# EAGLE schematic STM32f407layout (EAGLE 7.5.0)
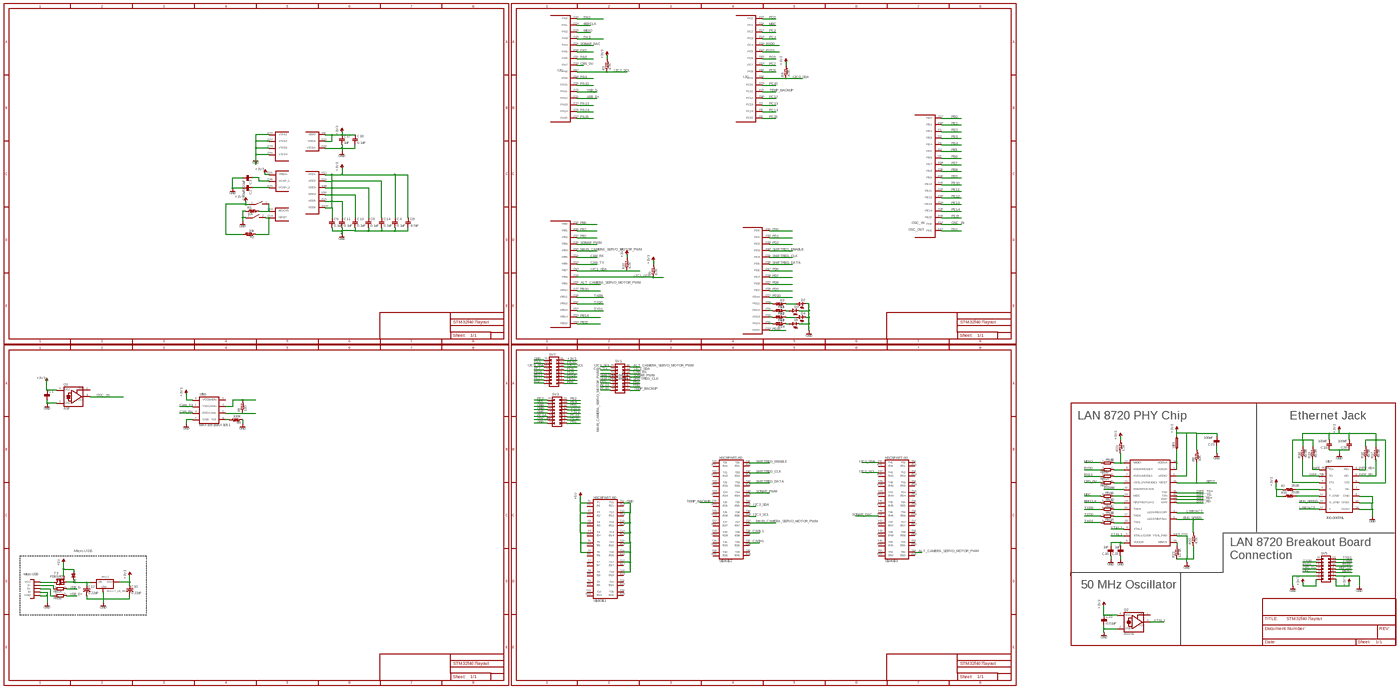
[diagram p0: schematic, sheet 1, overview]
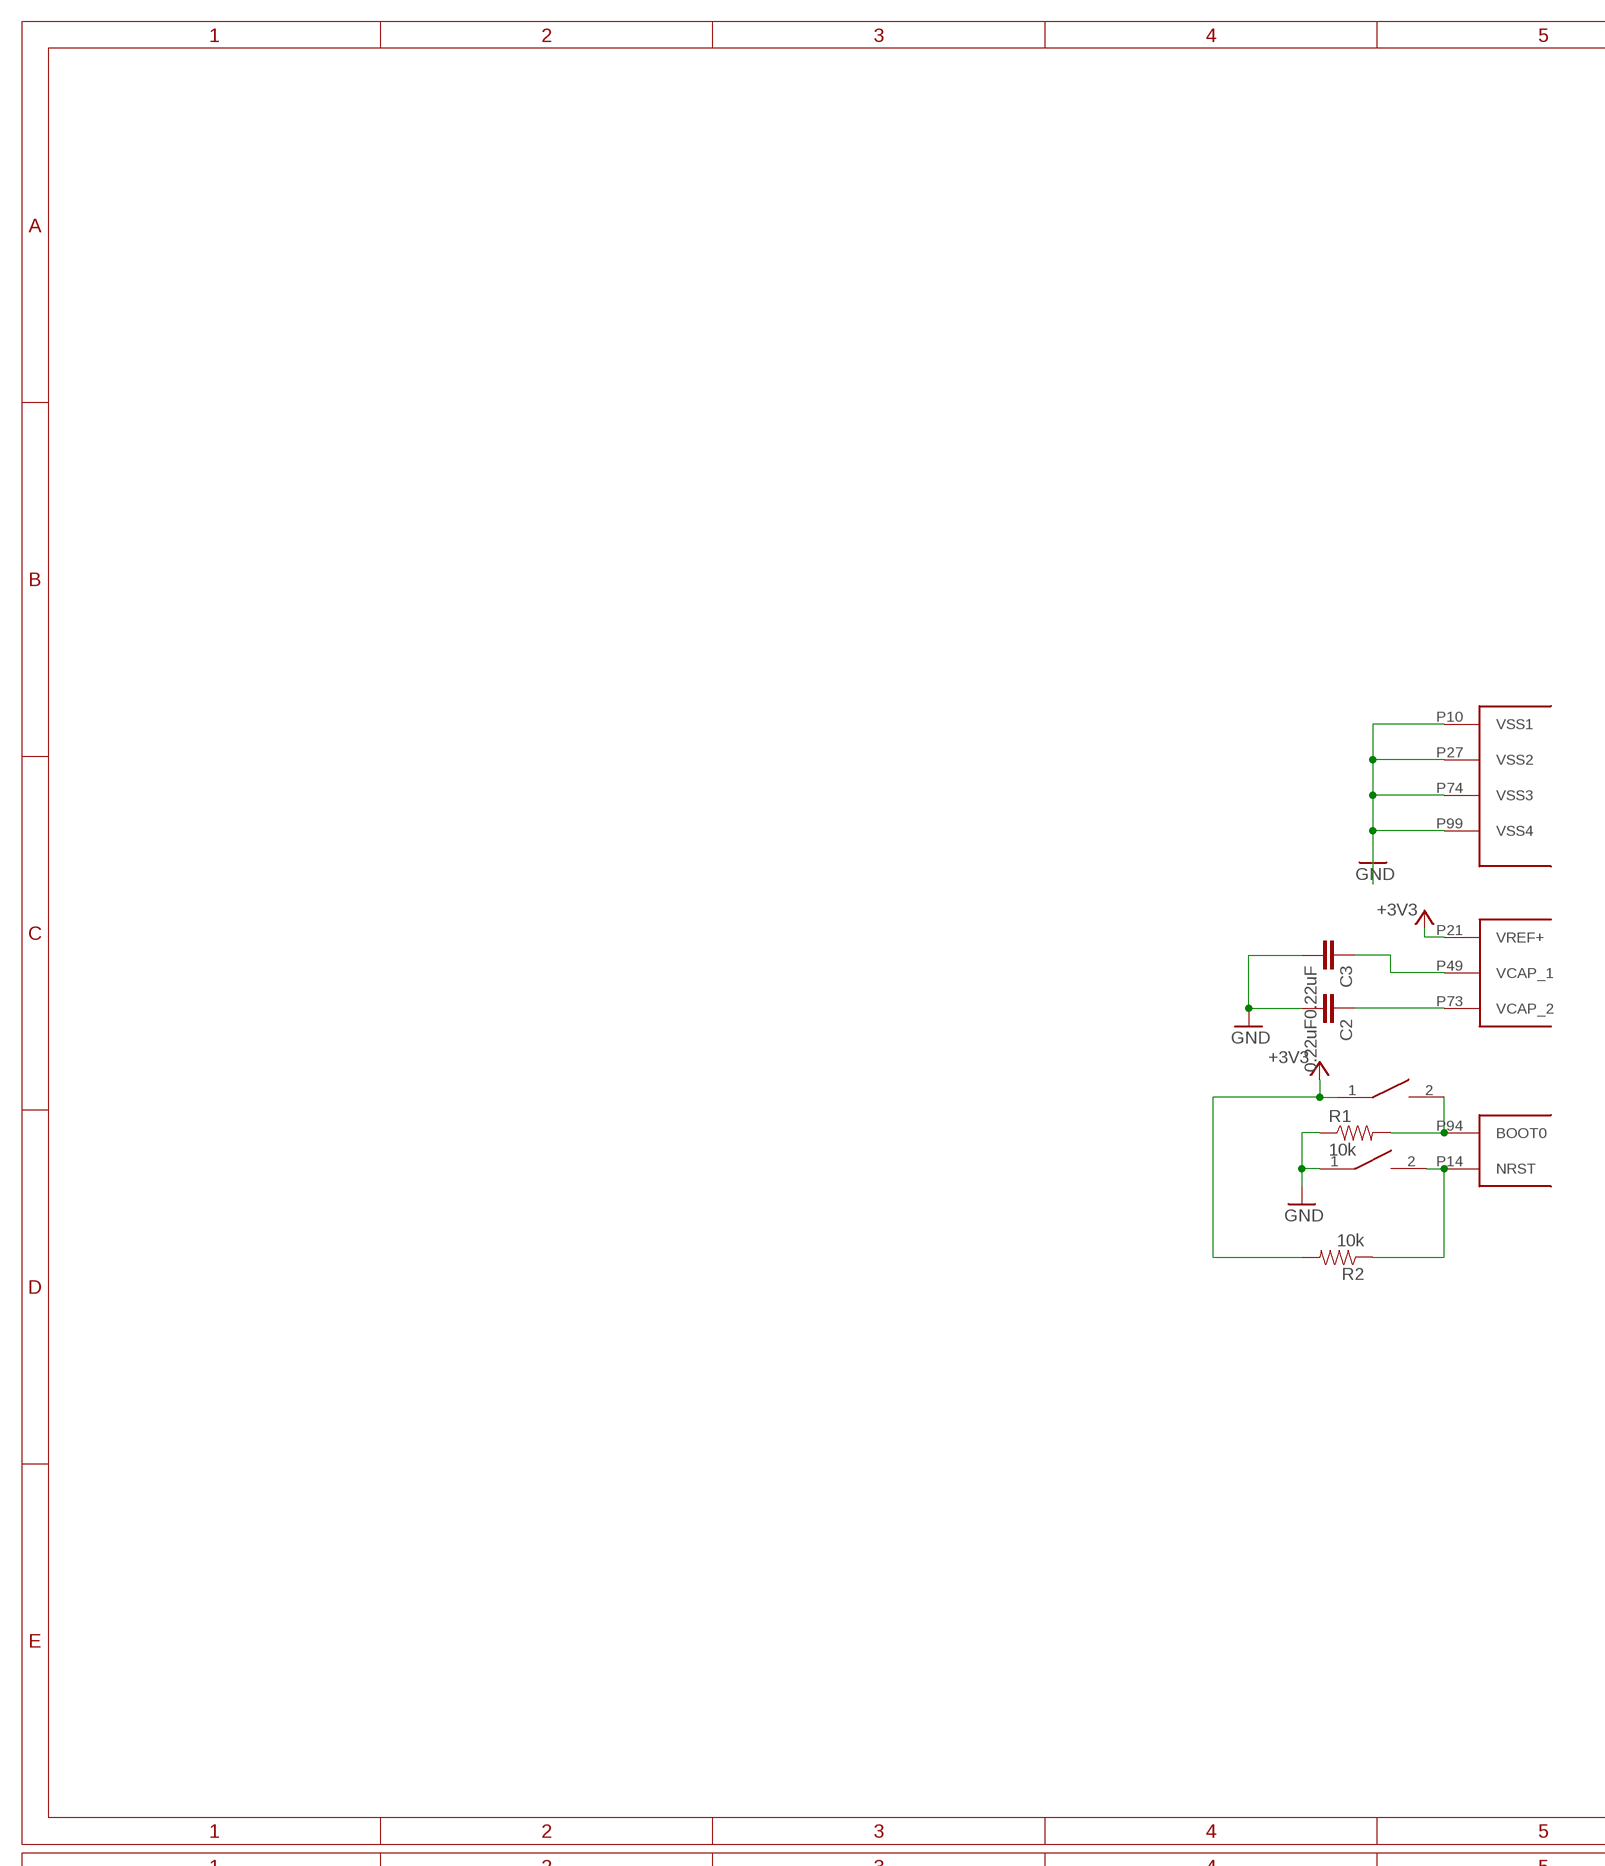
[diagram p1: schematic, sheet 1, part 1 of 7]
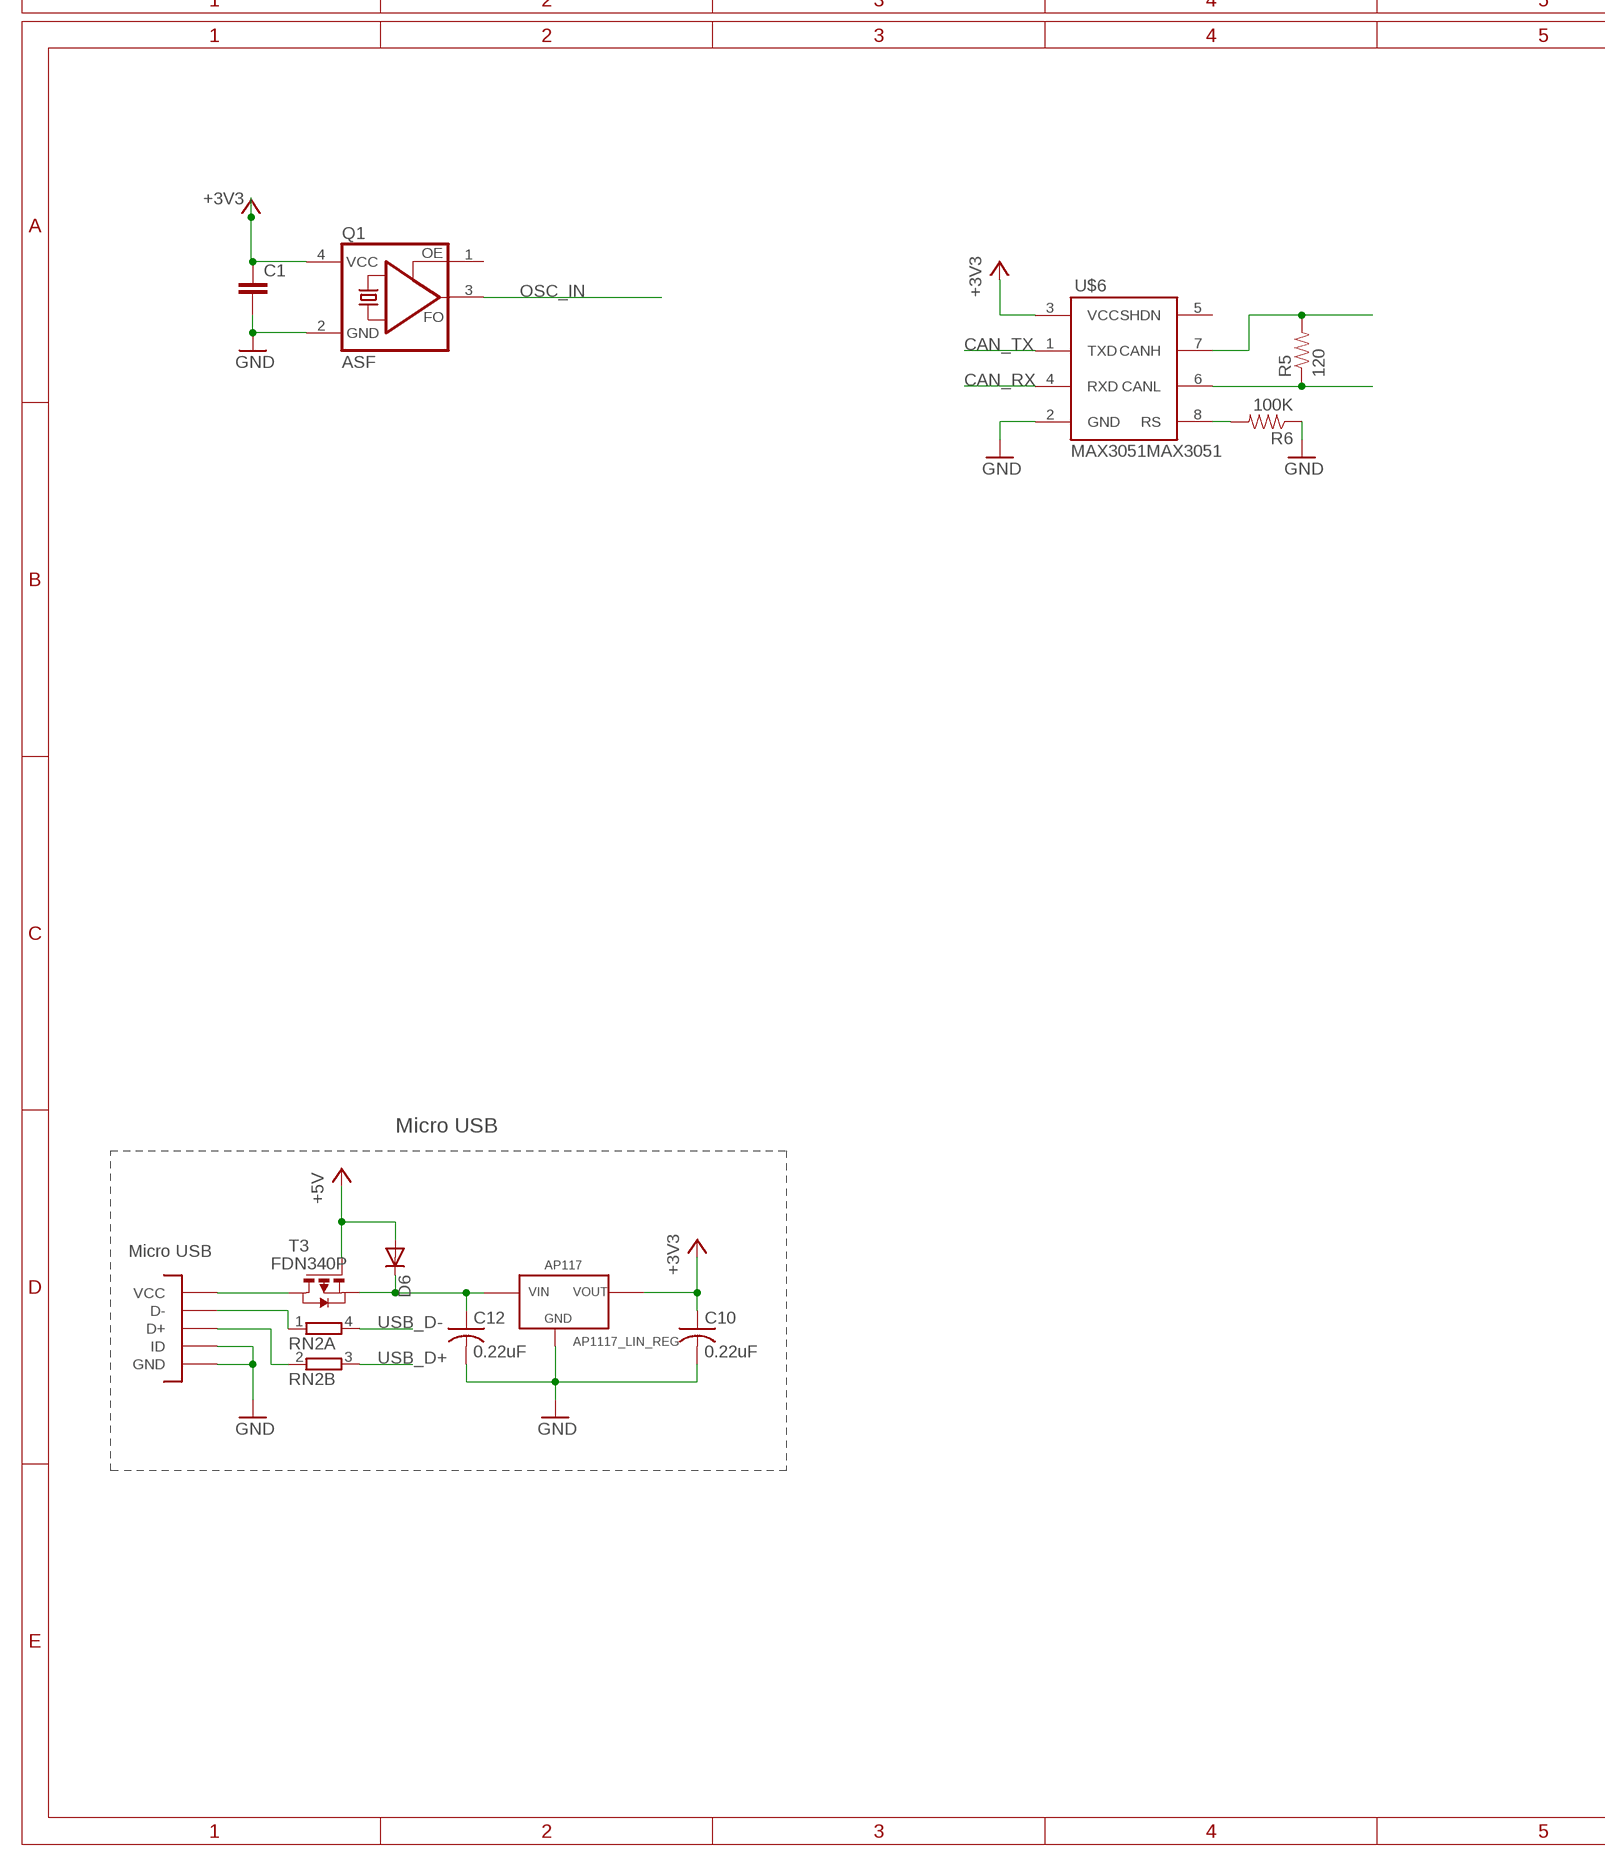
[diagram p2: schematic, sheet 1, part 2 of 7]
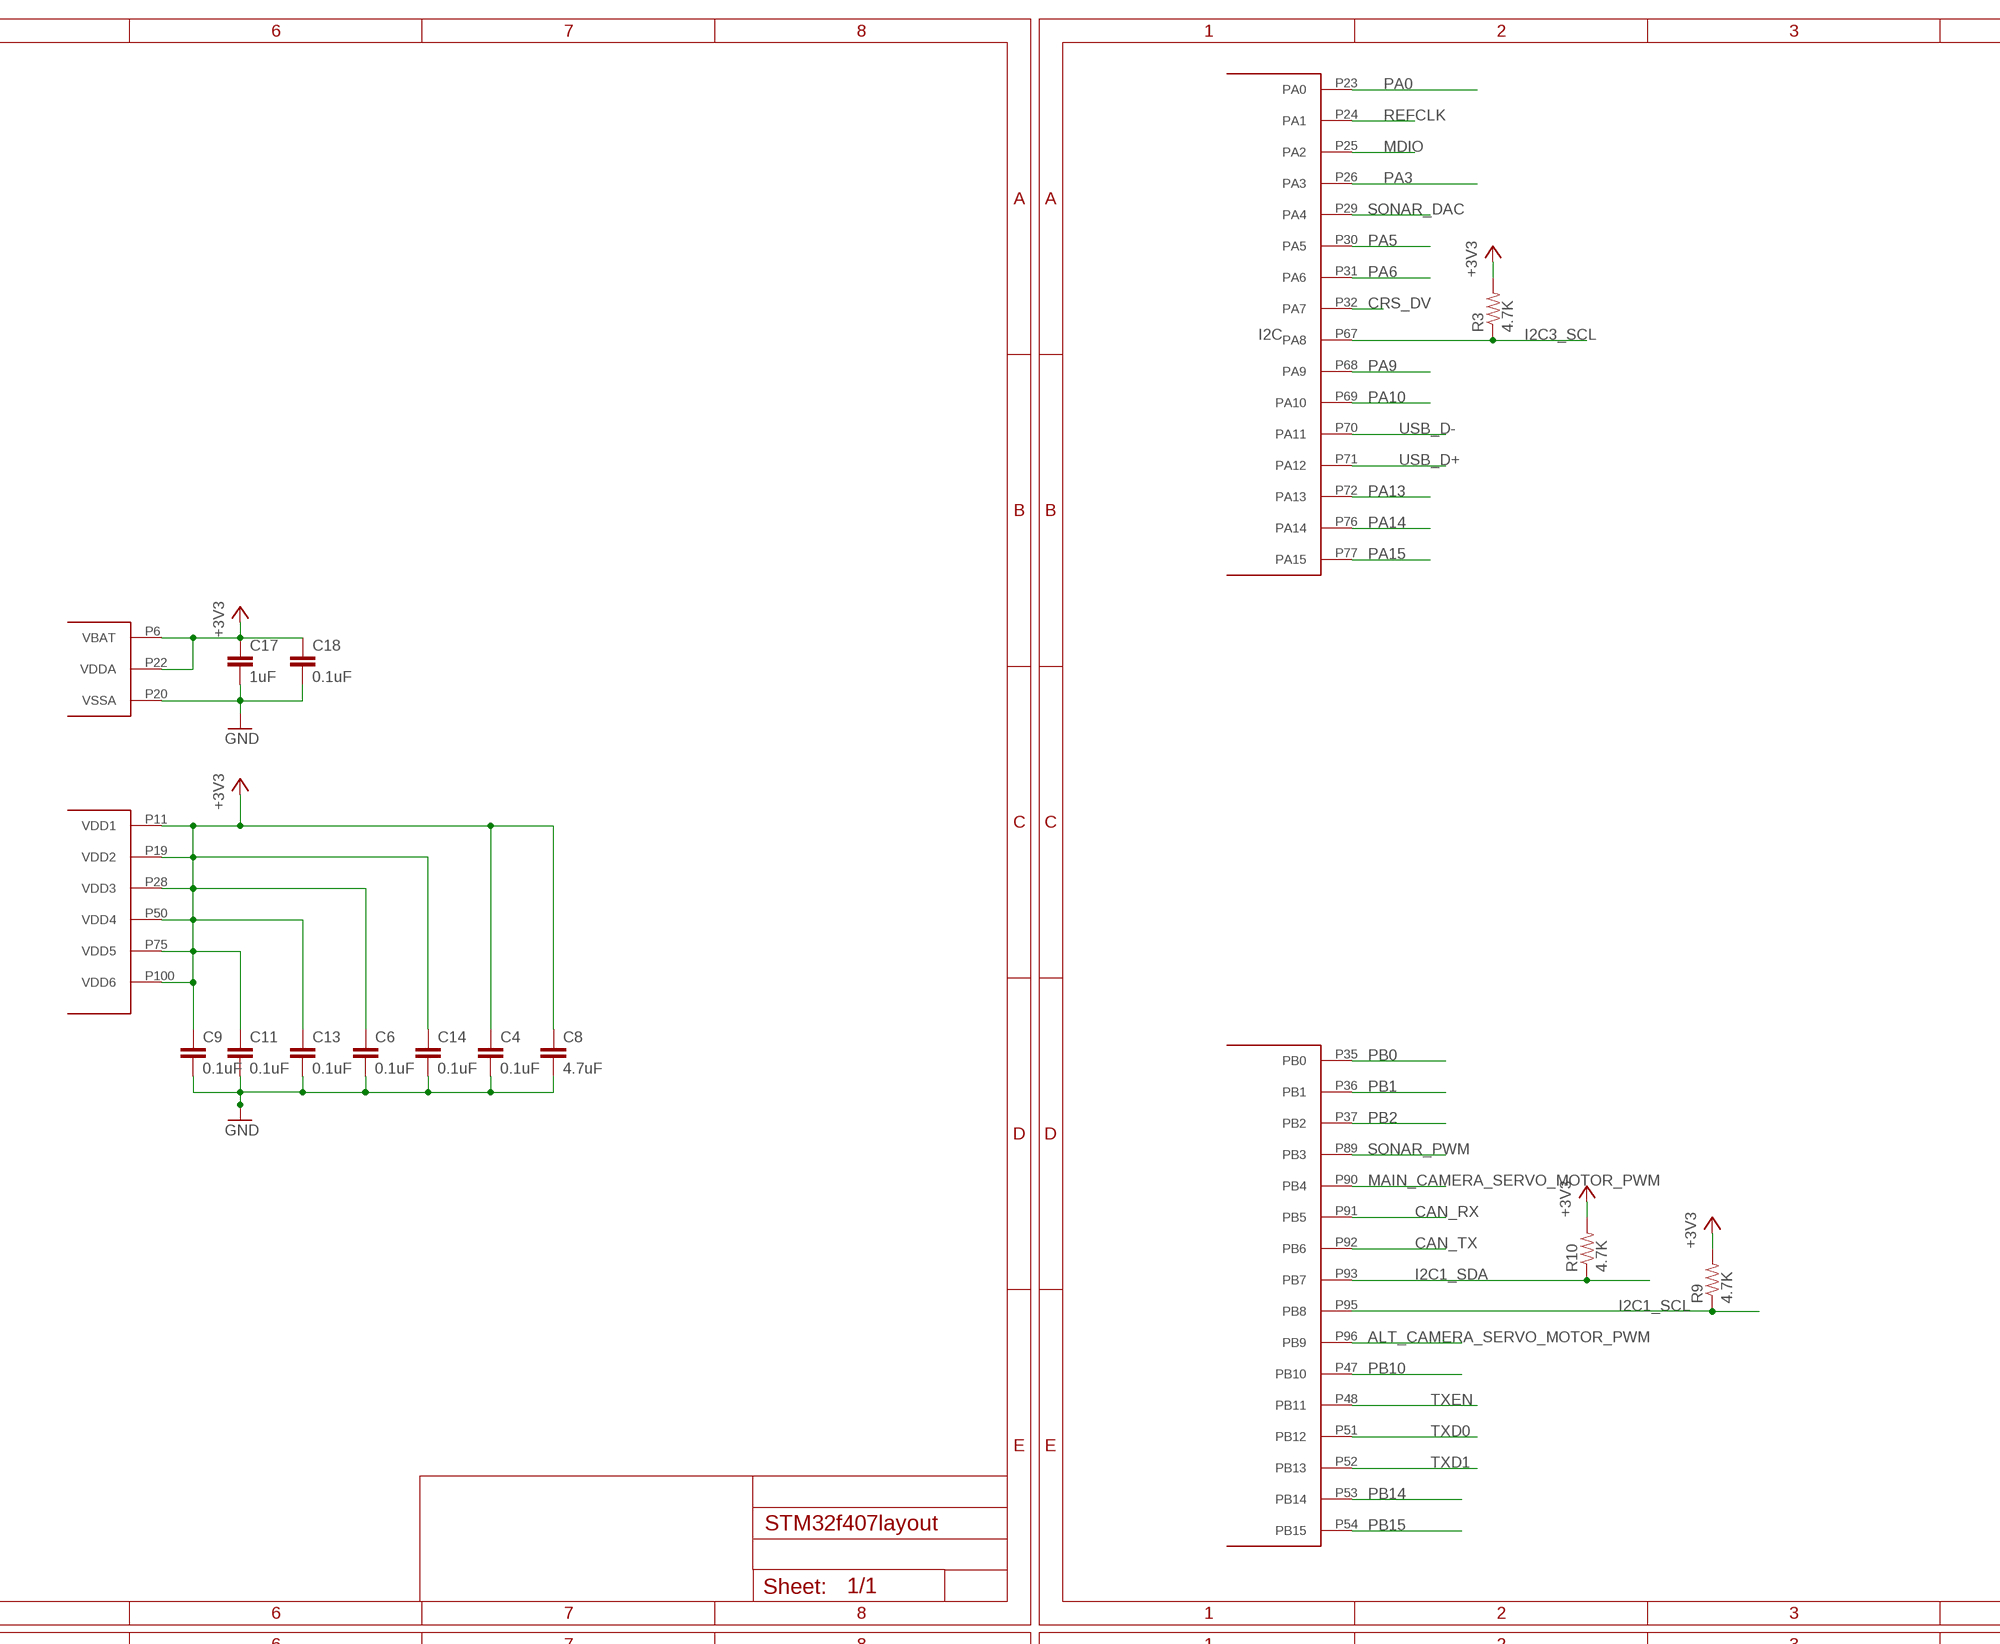
[diagram p3: schematic, sheet 1, part 3 of 7]
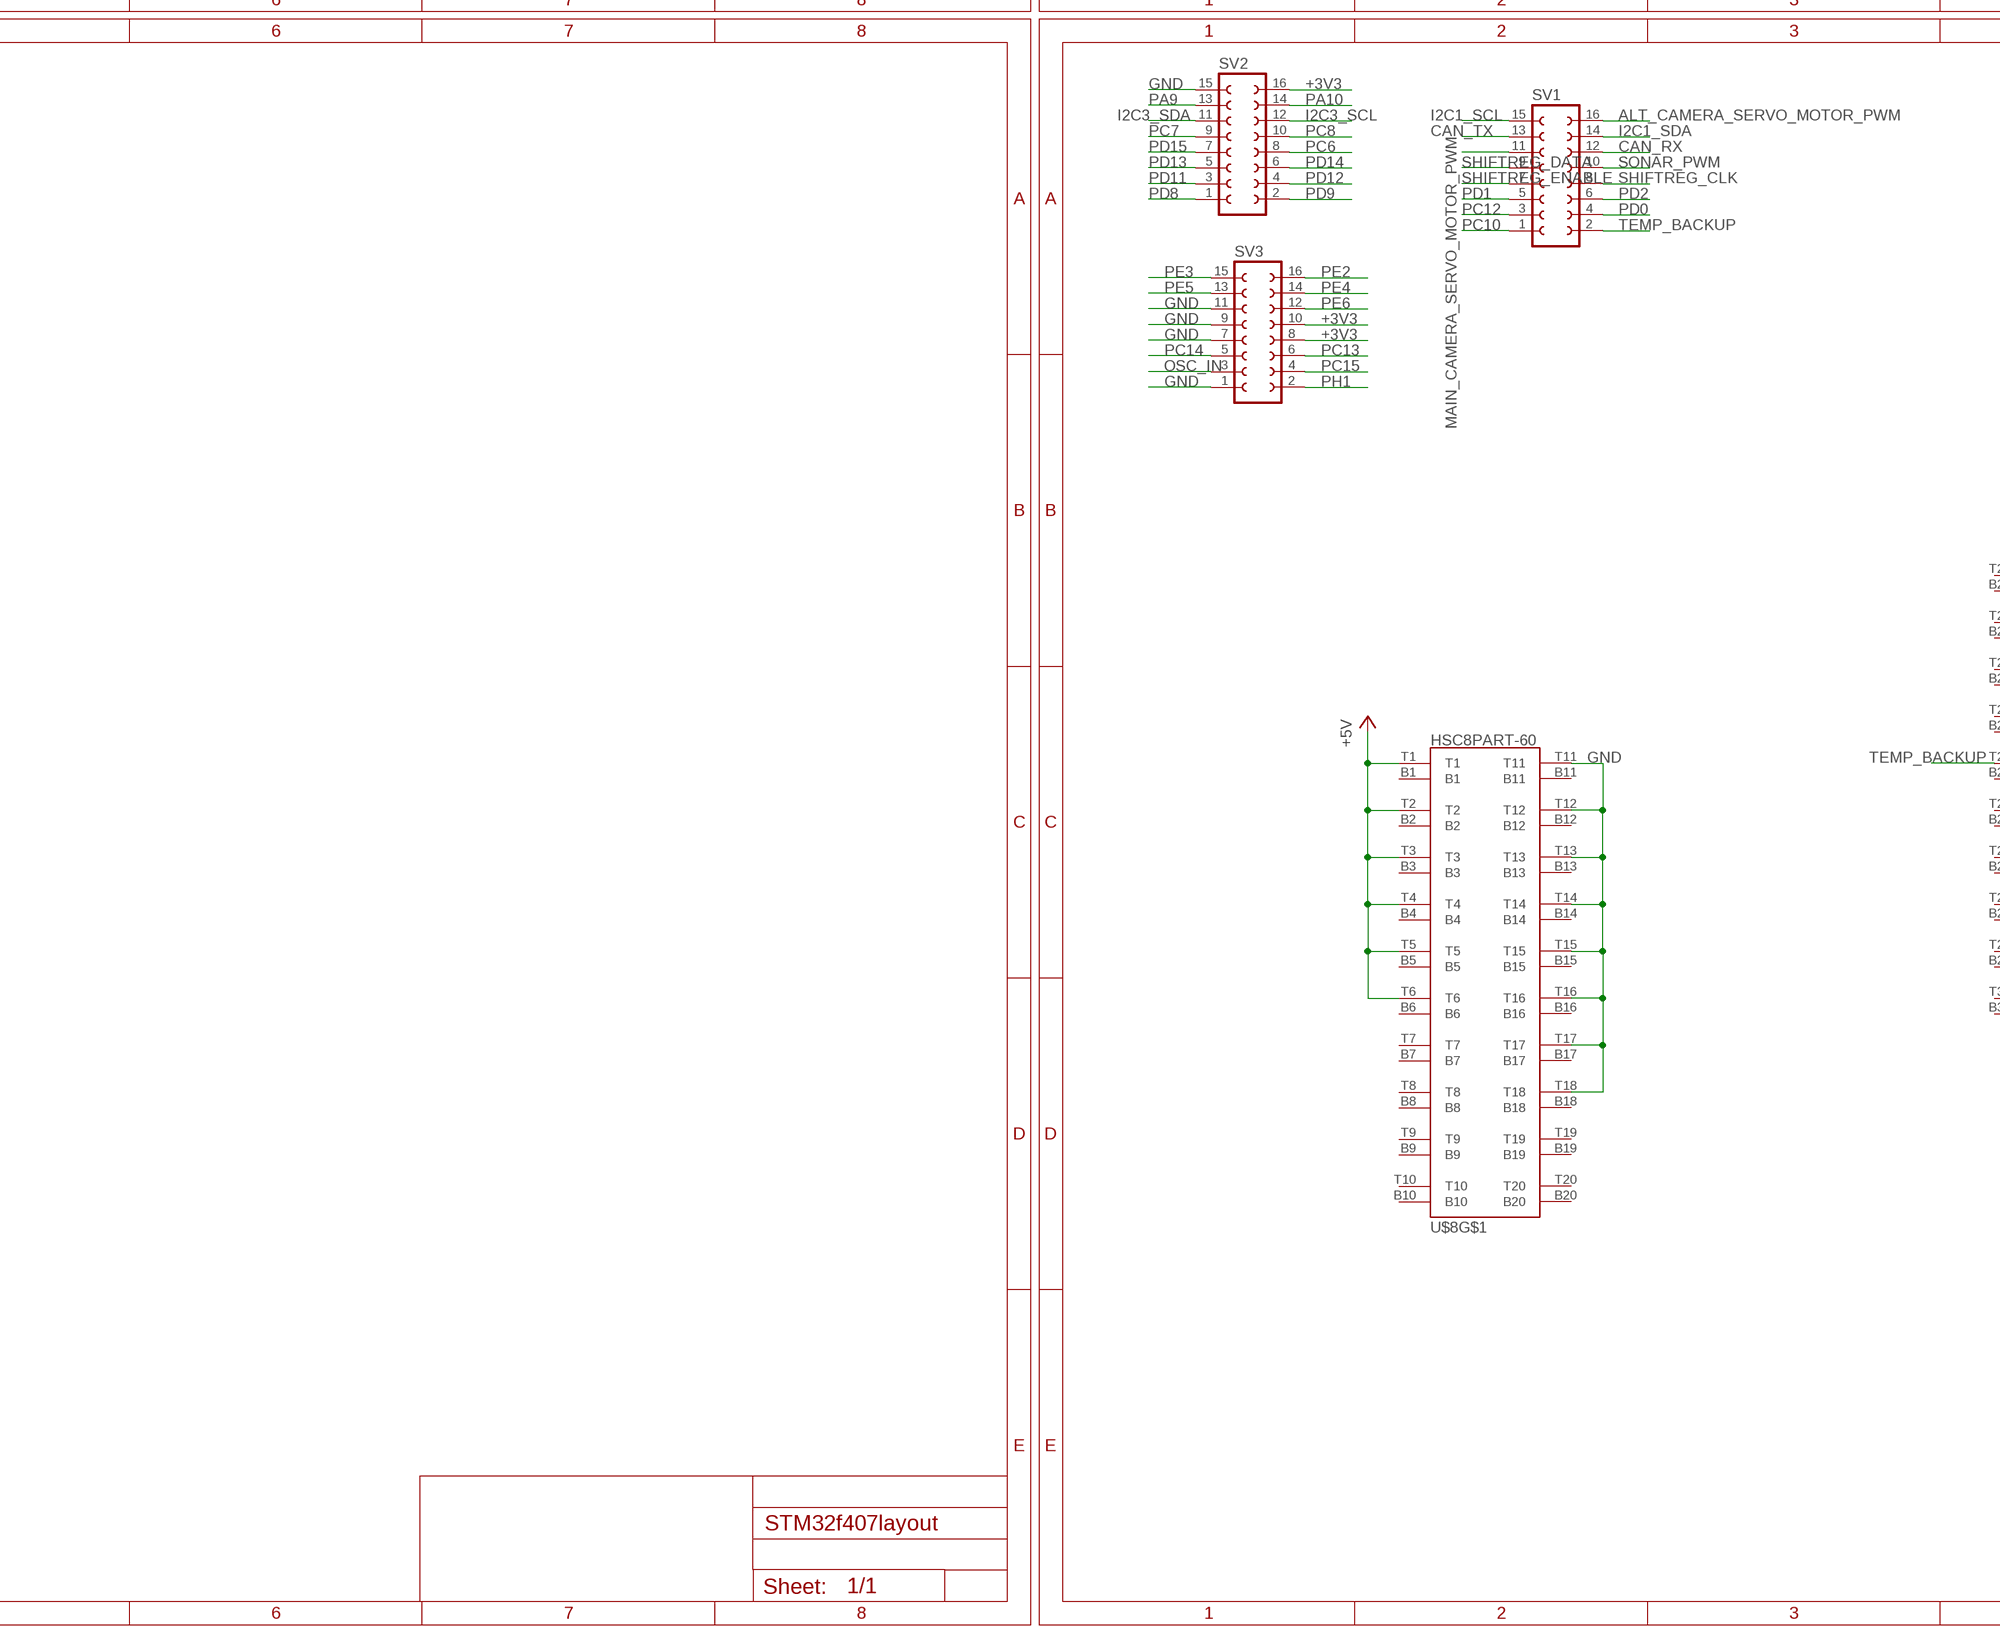
[diagram p4: schematic, sheet 1, part 4 of 7]
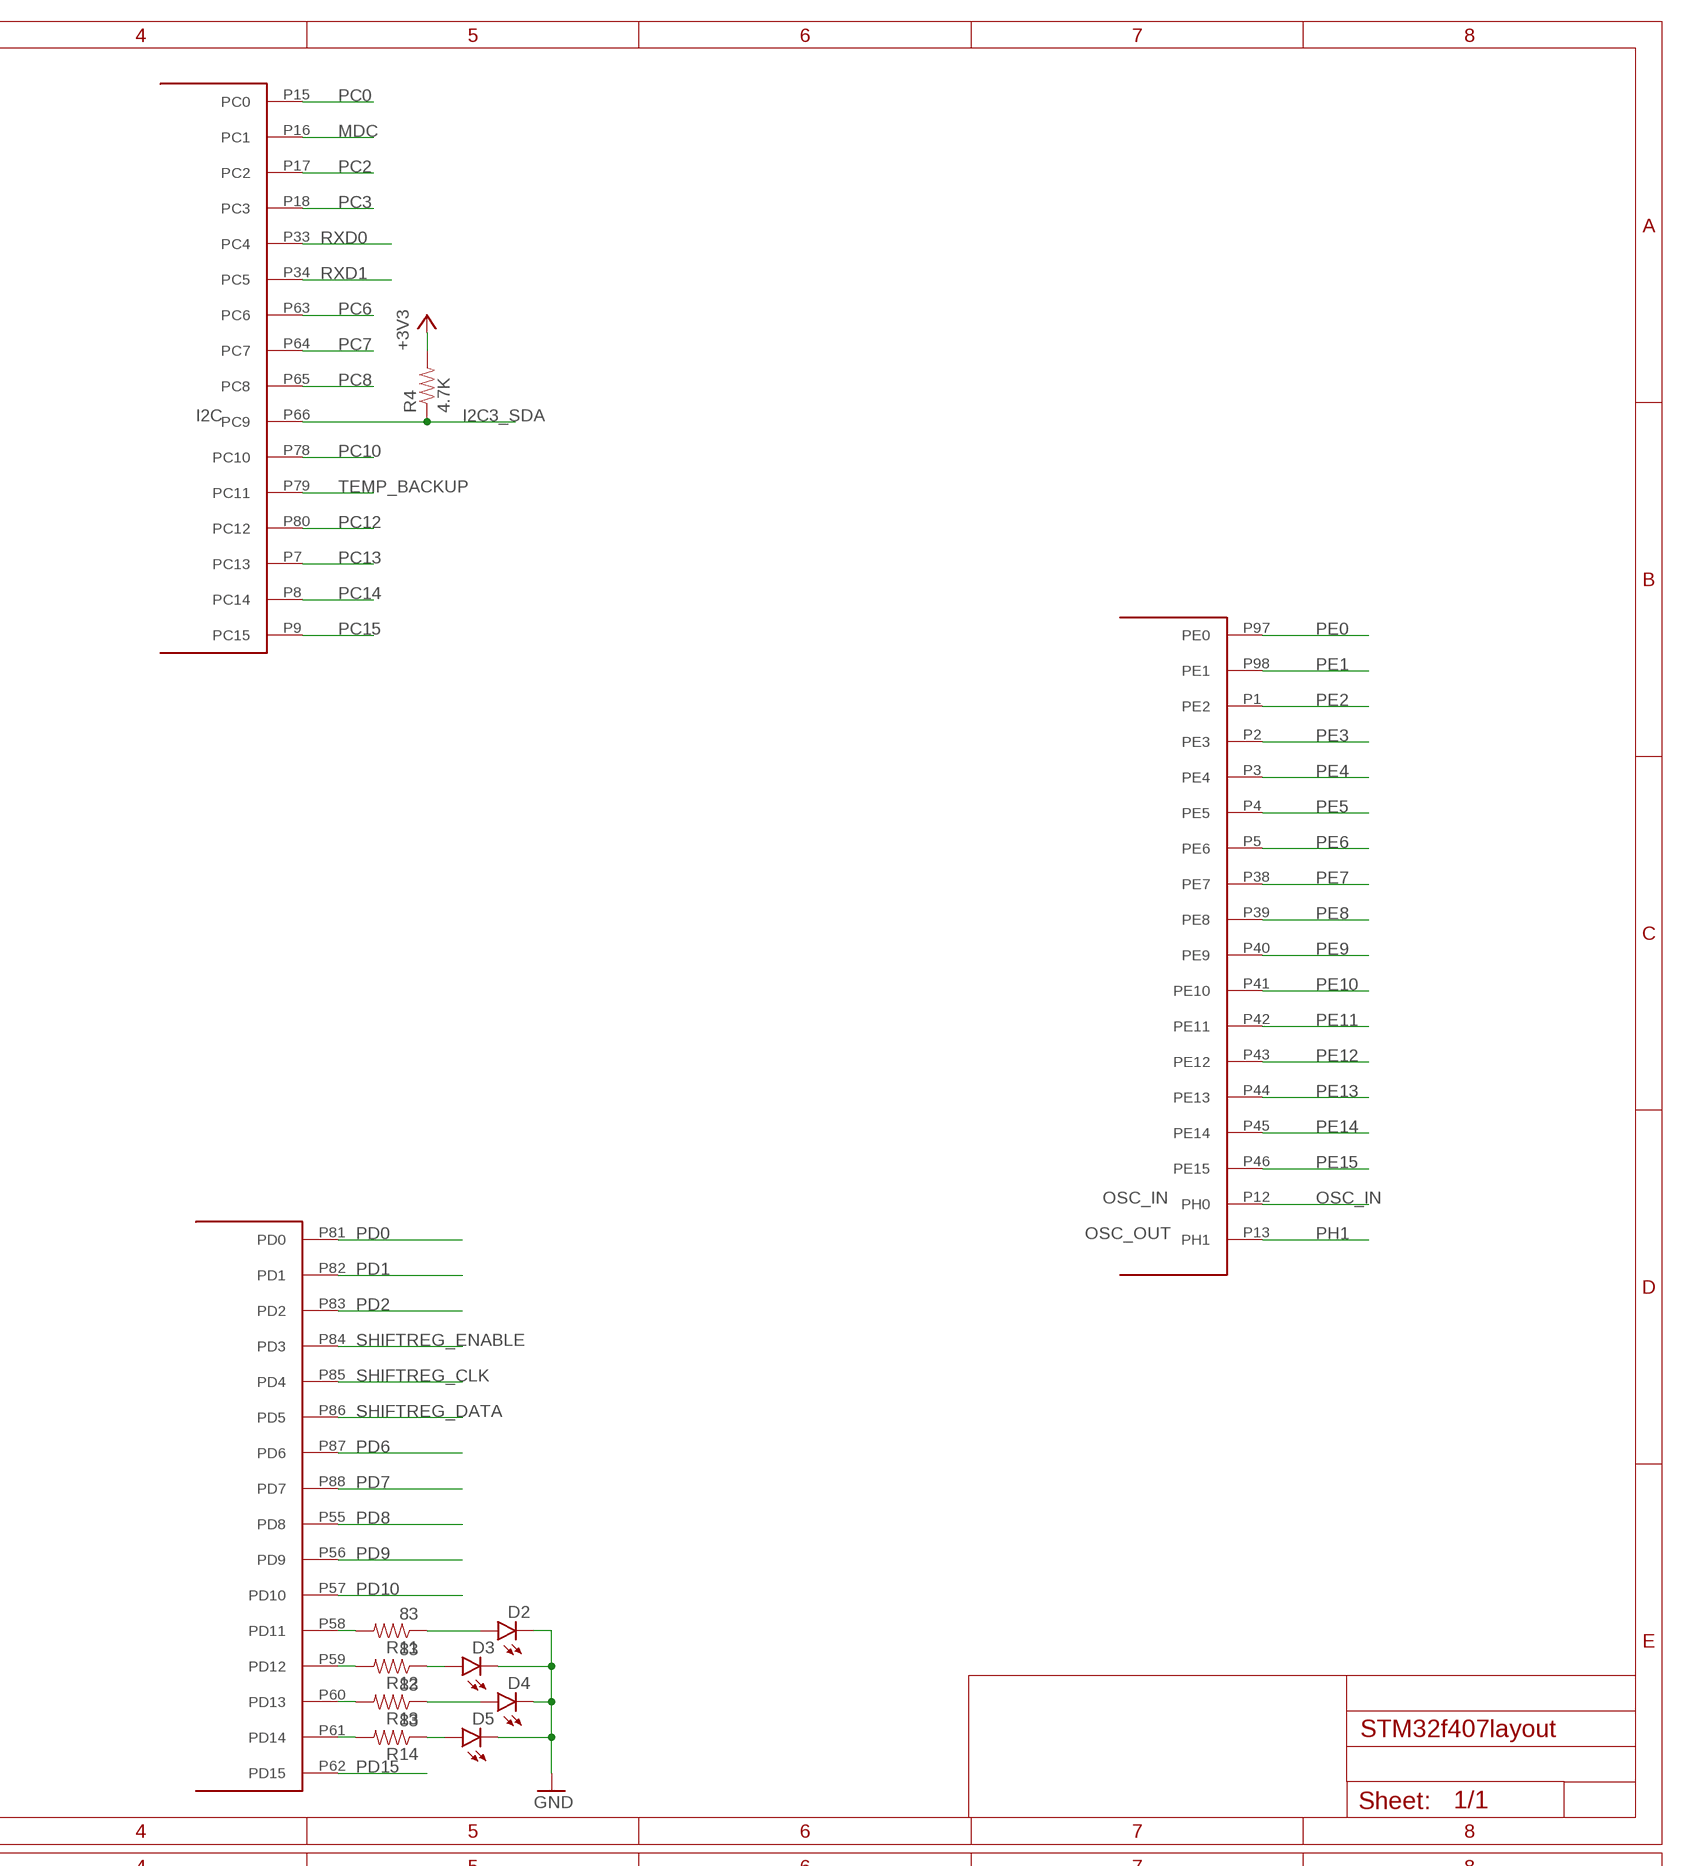
[diagram p5: schematic, sheet 1, part 5 of 7]
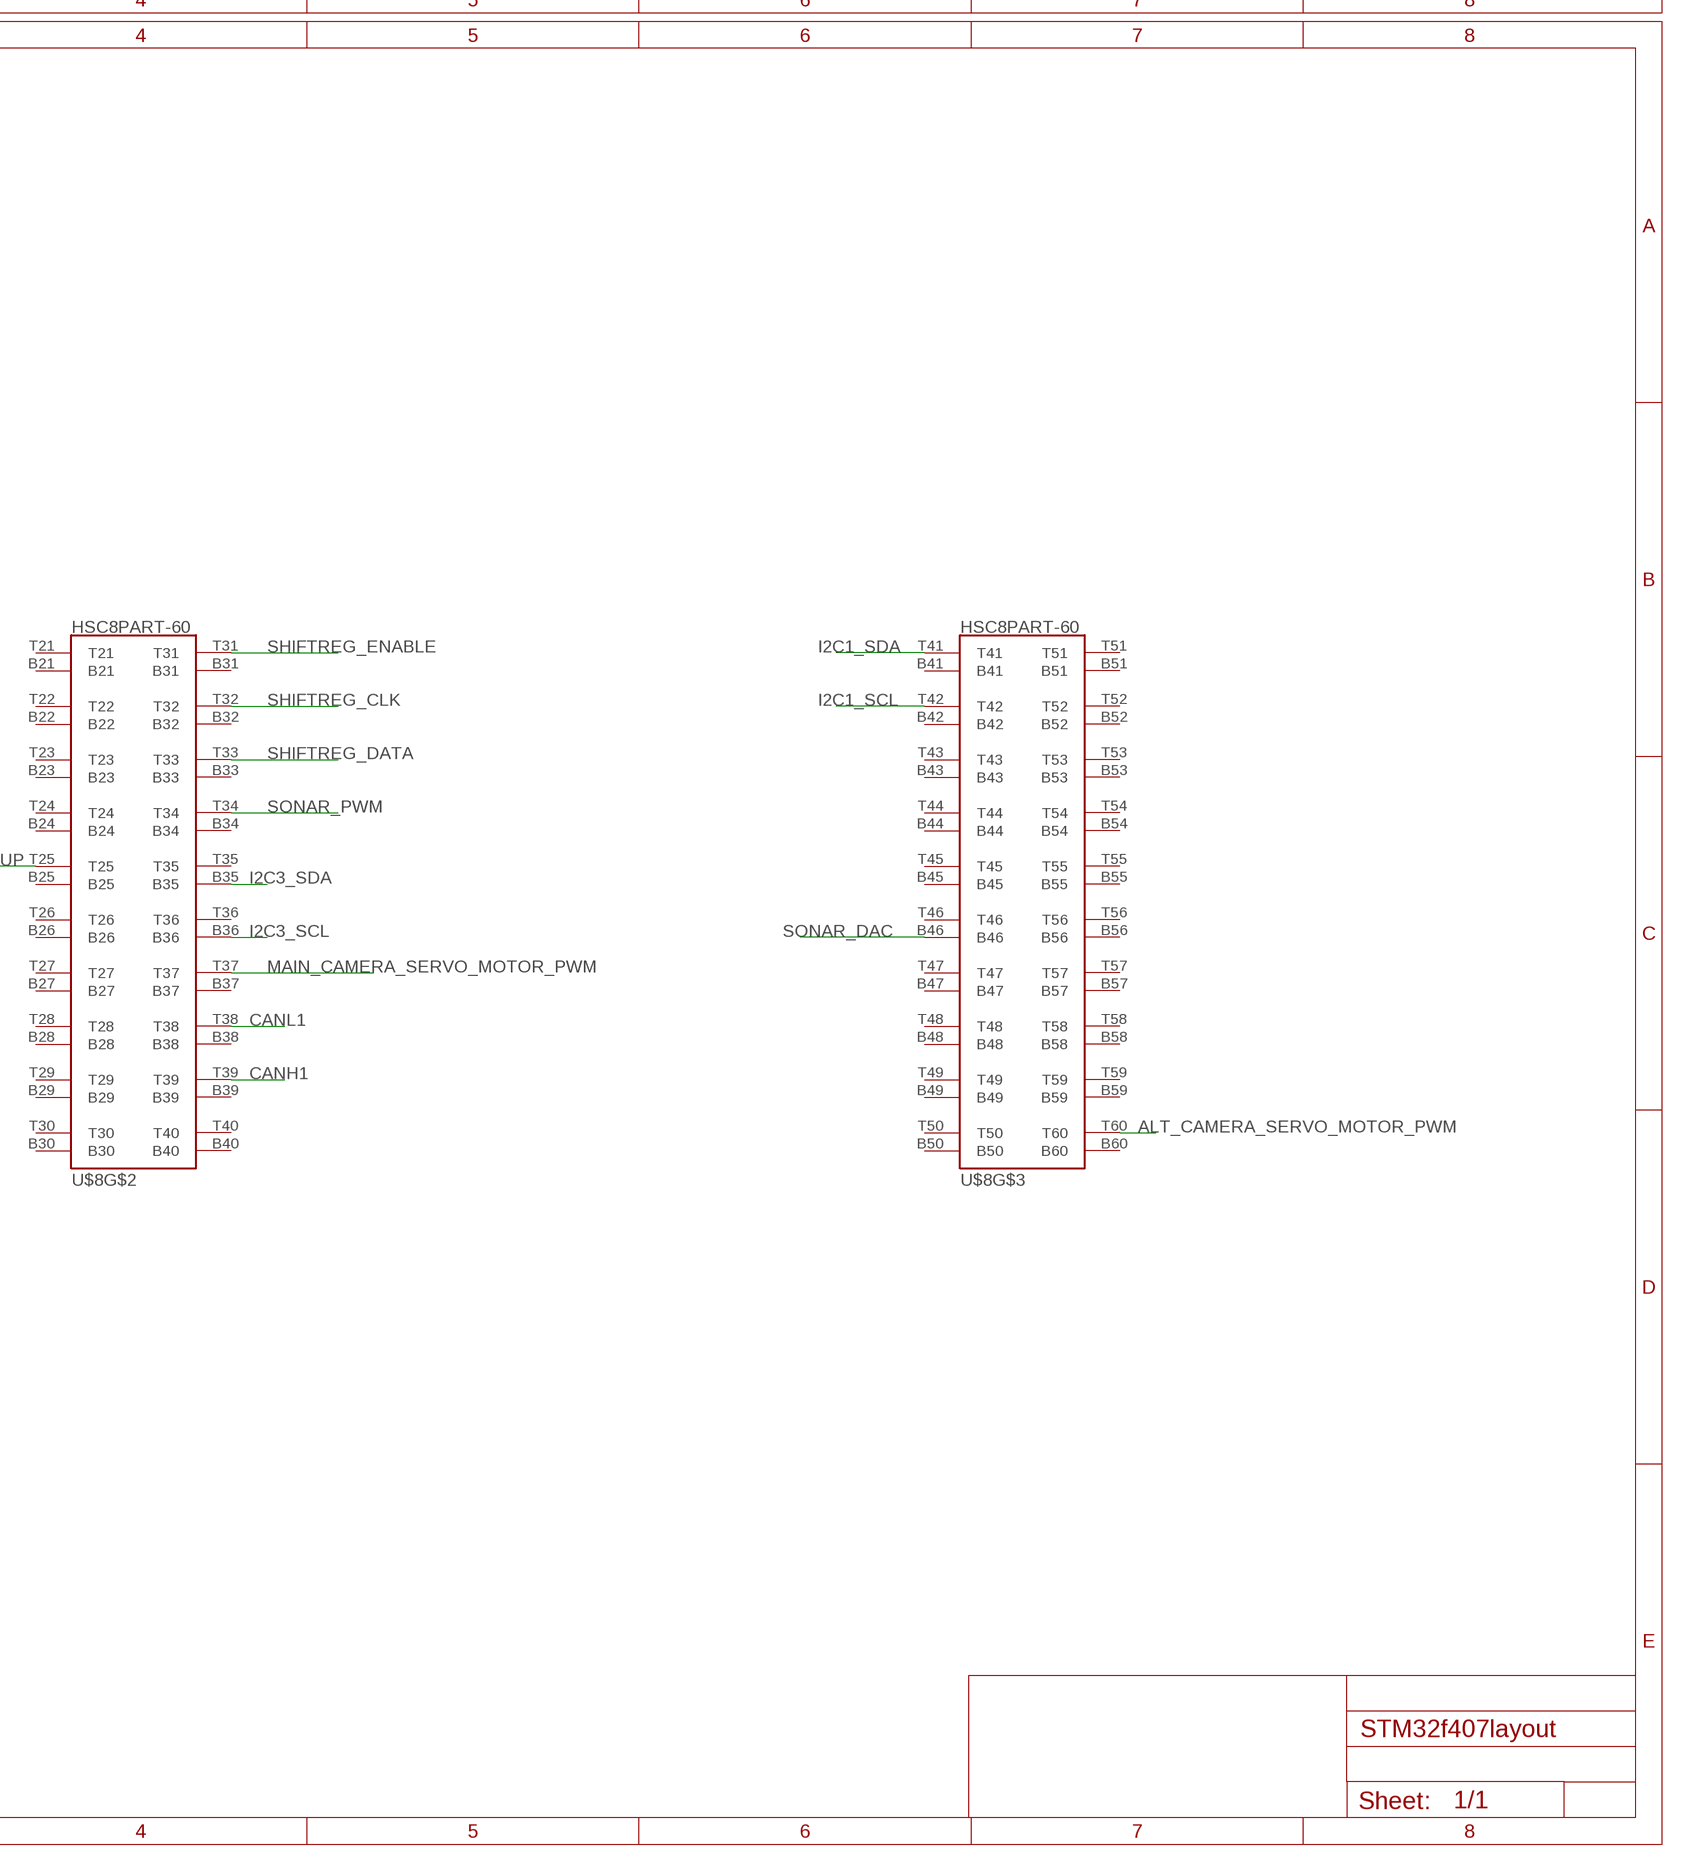
[diagram p6: schematic, sheet 1, part 6 of 7]
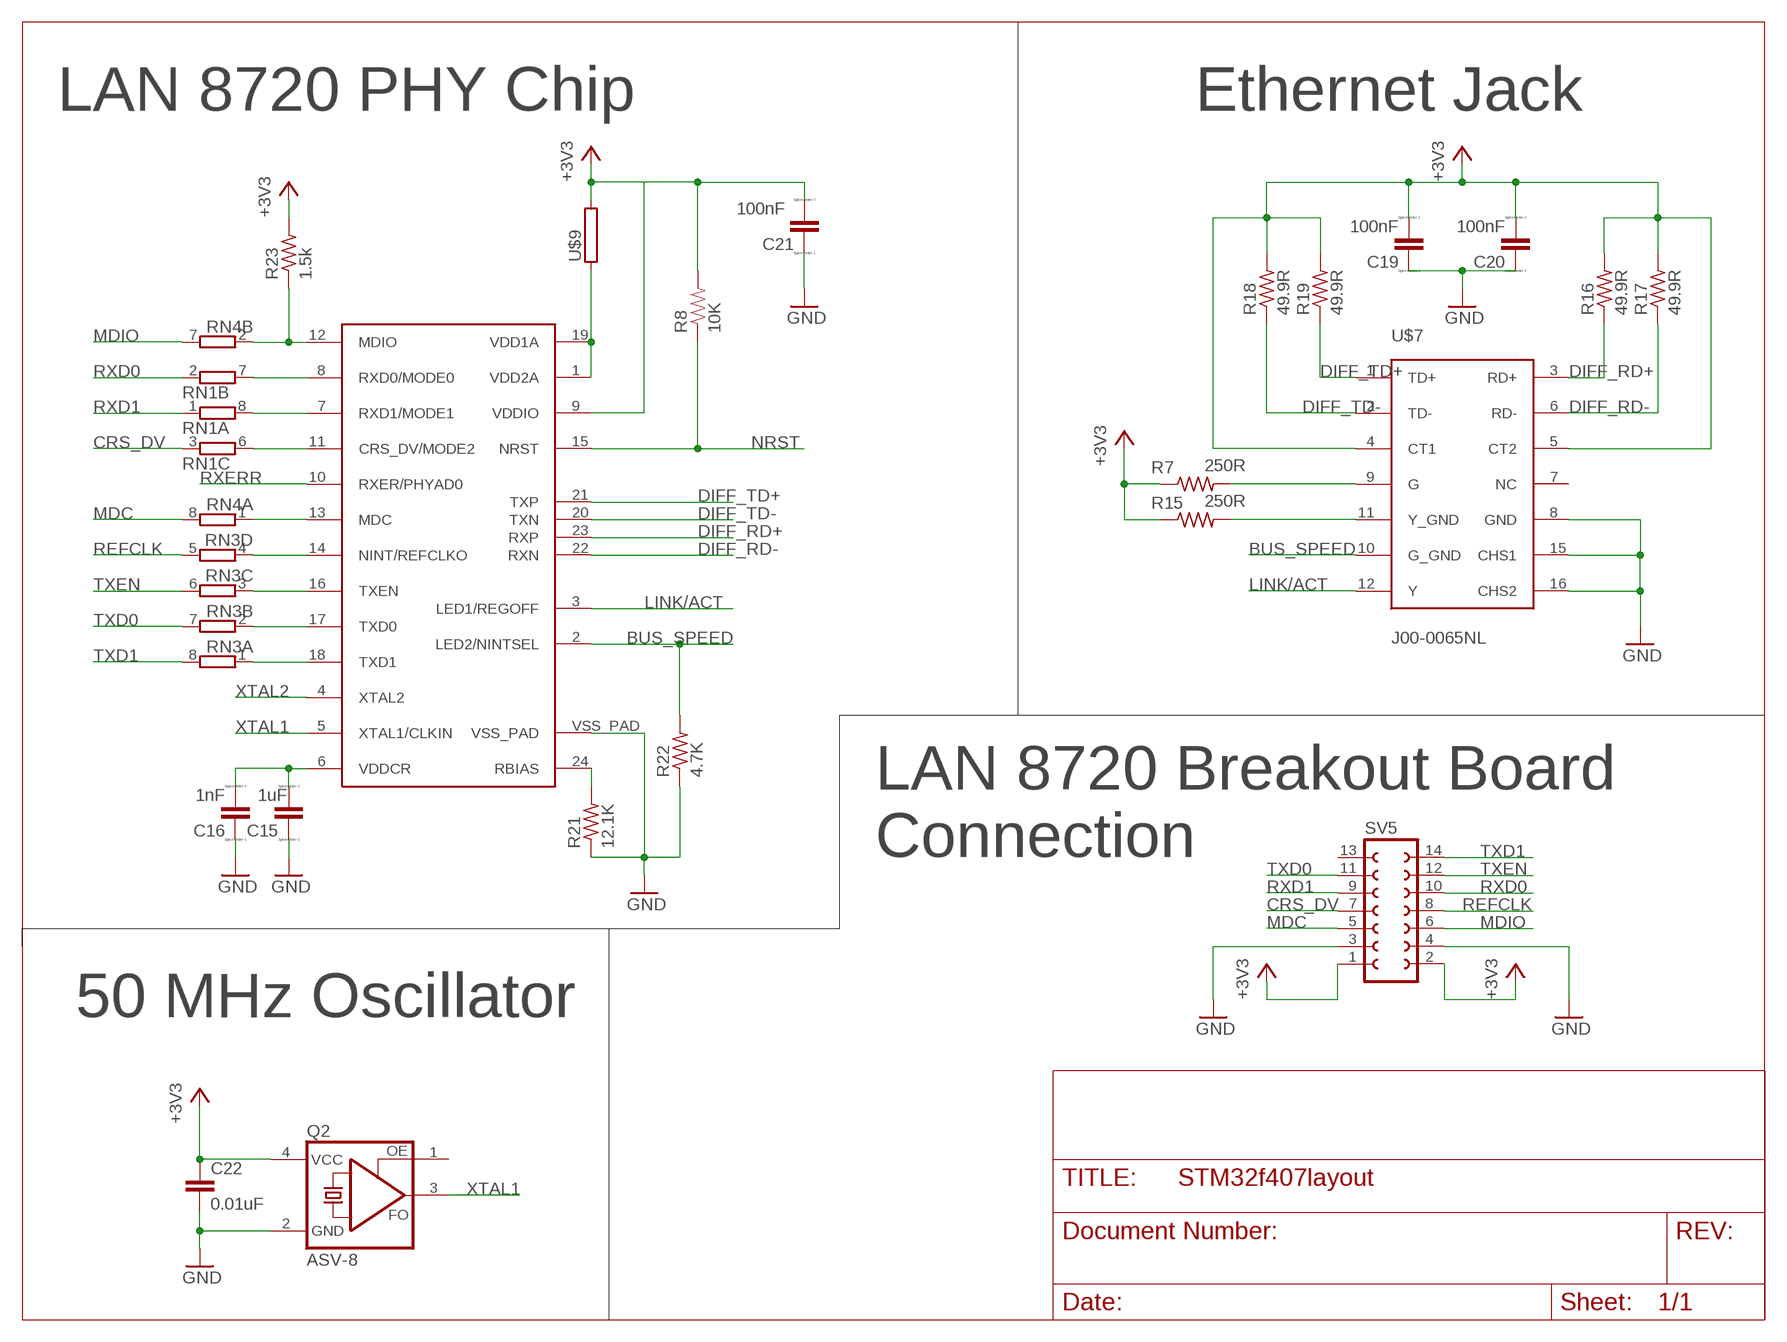
[diagram p7: schematic, sheet 1, part 7 of 7]

## Parts
C1  CAP0603-CAP  [0603-CAP]
C2  0.22uF  CAP0603-CAP  [0603-CAP]
C3  0.22uF  CAP0603-CAP  [0603-CAP]
C4  0.1uF  CAP0603-CAP  [0603-CAP]
C6  0.1uF  CAP0603-CAP  [0603-CAP]
C8  4.7uF  CAP0603-CAP  [0603-CAP]
C9  0.1uF  CAP0603-CAP  [0603-CAP]
C10  0.22uF  C-USC0603  [C0603]
C11  0.1uF  CAP0603-CAP  [0603-CAP]
C12  0.22uF  C-USC0603  [C0603]
C13  0.1uF  CAP0603-CAP  [0603-CAP]
C14  0.1uF  CAP0603-CAP  [0603-CAP]
C15  1uF  CC0603  [C0603]
C16  1nF  CC0603  [C0603]
C17  1uF  CAP0603-CAP  [0603-CAP]
C18  0.1uF  CAP0603-CAP  [0603-CAP]
C19  100nF  CC0603  [C0603]
C20  100nF  CC0603  [C0603]
C21  100nF  CC0603  [C0603]
C22  0.01uF  C-EUC0603  [C0603]
D2  LED0603  [LED-0603]
D3  LED0603  [LED-0603]
D4  LED0603  [LED-0603]
D5  LED0603  [LED-0603]
D6  DIODE-DO-214AC  [DO-214AC]
Q1  ASF  [ASF]
Q2  ASV-8  ASF  [ASF]
R1  10k  RESISTOR0603-RES  [0603-RES]
R2  10k  RESISTOR0603-RES  [0603-RES]
R3  4.7K  RESISTOR0603-RES  [0603-RES]
R4  4.7K  RESISTOR0603-RES  [0603-RES]
R5  120  RESISTOR0603-RES  [0603-RES]
R6  100K  RESISTOR0603-RES  [0603-RES]
R7  250R  R-US_R0603  [R0603]
R8  10K  RESISTOR0603-RES  [0603-RES]
R9  4.7K  RESISTOR0603-RES  [0603-RES]
R10  4.7K  RESISTOR0603-RES  [0603-RES]
R11  83  RESISTOR0603-RES  [0603-RES]
R12  83  RESISTOR0603-RES  [0603-RES]
R13  83  RESISTOR0603-RES  [0603-RES]
R14  83  RESISTOR0603-RES  [0603-RES]
R15  250R  R-US_R0603  [R0603]
R16  49.9R  R-US_R0603  [R0603]
R17  49.9R  R-US_R0603  [R0603]
R18  49.9R  R-US_R0603  [R0603]
R19  49.9R  R-US_R0603  [R0603]
R21  12.1K  R-US_R0603  [R0603]
R22  4.7K  R-US_R0603  [R0603]
R23  1.5k  R-US_R0603  [R0603]
RN1  4R-NCAY16  [CAY16]
RN2  2R-NEXBV4V  [EXBV4V]
RN3  4R-NCAY16  [CAY16]
RN4  4R-NCAY16  [CAY16]
SV1  FE08-2  [FE08-2]
SV2  FE08-2  [FE08-2]
SV3  FE08-2  [FE08-2]
SV5  FE07-2  [FE07-2]
T3  FDN340P  [SOT-23]
T4  AP1117_LIN_REG  [SOT223]
U$1  STM32F4  [LQFP100]
U$2  SWITCH  [SW_2512]
U$3  SWITCH  [SW_2512]
U$4  LAN8720LAN8720  [24-QFN]
U$5  MICROUSB  [MICRO_B]
U$6  MAX3051MAX3051  [SOT23-8L]
U$7  J00-0065NL  [J00-0065NL]
U$8  HSC8PART-60  [HSC8-60PINOUUT]
U$9  553-2382-1-ND  [0603]

## Nets
+3V3: C1.1 C4.1 C6.1 C8.1 C9.1 C10.1 C11.1 C13.1 C14.1 C17.1 C18.1 C19.2 C20.2 C21.2 C22.1 Q1.4(VCC) Q2.4(VCC) R2.2 R3.2 R4.2 R7.1 R8.2 R9.2 R10.2 R15.1 R16.2 R17.2 R18.2 R19.2 R23.2 SV2.16 SV3.8 SV3.10 SV5.1 SV5.2 T4.TAB(VOUT) T4.VOUT U$1.P6(VBAT) U$1.P11(VDD1) U$1.P19(VDD2) U$1.P21(VREF+) U$1.P22(VDDA) U$1.P28(VDD3) U$1.P50(VDD4) U$1.P75(VDD5) U$1.P100(VDD6) U$3.1 U$4.9(VDDIO) U$6.3(VCC) U$7.4(CT1) U$7.5(CT2) U$9.2
+5V: D6.A T3.3(G) U$8.T1 U$8.T2 U$8.T3 U$8.T4 U$8.T5 U$8.T6
ALT_CAMERA_SERVO_MOTOR_PWM: SV1.16 U$1.P96(PB9) U$8.T60
BUS_SPEED: R22.2 U$4.2(LED2/NINTSEL) U$7.10(G_GND)
CAN_RX: SV1.12 U$1.P91(PB5) U$6.4(RXD)
CAN_TX: SV1.13 U$1.P92(PB6) U$6.1(TXD)
CANH1: R5.2 U$6.7(CANH) U$8.T39
CANL1: R5.1 U$6.6(CANL) U$8.T38
CRS_DV: RN1.3 SV5.7 U$1.P32(PA7)
DIFF_RD+ [DiffPair]: R16.1 U$4.23(RXP) U$7.3(RD+)
DIFF_RD- [DiffPair]: R17.1 U$4.22(RXN) U$7.6(RD-)
DIFF_TD+ [DiffPair]: R19.1 U$4.21(TXP) U$7.1(TD+)
DIFF_TD- [DiffPair]: R18.1 U$4.20(TXN) U$7.2(TD-)
GND: C1.2 C2.2 C3.2 C4.2 C6.2 C8.2 C9.2 C10.2 C11.2 C12.2 C13.2 C14.2 C15.1 C16.1 C17.2 C18.2 C19.1 C20.1 C21.1 C22.2 D2.C D3.C D4.C D5.C Q1.2(GND) Q2.2(GND) R1.1 R6.1 R21.1 R22.1 SV2.15 SV3.1 SV3.7 SV3.9 SV3.11 SV5.3 SV5.4 T4.GND U$1.P10(VSS1) U$1.P20(VSSA) U$1.P27(VSS2) U$1.P74(VSS3) U$1.P99(VSS4) U$2.1 U$4.VSS_PAD U$5.GND1(GND) U$5.GND2(GND) U$5.GND3(GND) U$5.GND4(GND) U$5.GND7(GND) U$5.GND8(GND) U$5.P4(ID) U$5.P5(GND) U$6.2(GND) U$7.8(GND) U$7.15(CHS1) U$7.16(CHS2) U$8.T11 U$8.T12 U$8.T13 U$8.T14 U$8.T15 U$8.T16 U$8.T17 U$8.T18
GREEN: R7.2 U$7.9(G)
I2C1_SCL: R9.1 SV1.15 U$1.P95(PB8) U$8.T42
I2C1_SDA: R10.1 SV1.14 U$1.P93(PB7) U$8.T41
I2C3_SCL: R3.1 SV2.12 U$1.P67(PA8) U$8.B36
I2C3_SDA: R4.1 SV2.11 U$1.P66(PC9) U$8.B35
LINK/ACT: U$4.3(LED1/REGOFF) U$7.12(Y)
MAIN_CAMERA_SERVO_MOTOR_PWM: SV1.11 U$1.P90(PB4) U$8.T37
MDC: RN4.8 SV5.5 U$1.P16(PC1)
MDE: RN4.1 U$4.13(MDC)
MDIO: RN4.7 SV5.6 U$1.P25(PA2)
N$1: C2.1 U$1.P73(VCAP_2)
N$2: C3.1 U$1.P49(VCAP_1)
N$3: R1.2 U$1.P94(BOOT0) U$3.2
N$4: R2.1 U$1.P14(NRST) U$2.2
N$6: C15.2 C16.2 U$4.6(VDDCR)
N$9: RN1.6 U$4.11(CRS_DV/MODE2)
N$11: R6.2 U$6.8(RS)
N$12: RN2.1 U$5.P2(D-)
N$13: RN3.4 U$4.14(NINT/REFCLKO)
N$14: D3.A R12.1
N$15: D5.A R14.1
N$16: RN3.3 U$4.16(TXEN)
N$17: D4.A R13.1
N$18: D2.A R11.1
N$19: RN3.2 U$4.17(TXD0)
N$20: RN3.1 U$4.18(TXD1)
N$21: U$4.1(VDD2A) U$4.19(VDD1A) U$9.1
N$22: R21.2 U$4.24(RBIAS)
N$23: R23.1 RN4.2 U$4.12(MDIO)
N$24: RN2.2 U$5.P3(D+)
N$25: RN1.7 U$4.8(RXD0/MODE0)
N$26: RN1.8 U$4.7(RXD1/MODE1)
N$57: T3.1(D) U$5.P1(VCC)
N$58: C12.1 D6.C T3.2(S) T4.VIN
NRST: R8.1 U$4.15(NRST)
OSC_IN: Q1.3(FO) SV3.3 U$1.P12(PH0)
PA0: U$1.P23(PA0)
PA3: U$1.P26(PA3)
PA5: U$1.P30(PA5)
PA6: U$1.P31(PA6)
PA9: SV2.13 U$1.P68(PA9)
PA10: SV2.14 U$1.P69(PA10)
PA13: U$1.P72(PA13)
PA14: U$1.P76(PA14)
PA15: U$1.P77(PA15)
PB0: U$1.P35(PB0)
PB1: U$1.P36(PB1)
PB2: U$1.P37(PB2)
PB10: U$1.P47(PB10)
PB14: U$1.P53(PB14)
PB15: U$1.P54(PB15)
PC0: U$1.P15(PC0)
PC2: U$1.P17(PC2)
PC3: U$1.P18(PC3)
PC6: SV2.8 U$1.P63(PC6)
PC7: SV2.9 U$1.P64(PC7)
PC8: SV2.10 U$1.P65(PC8)
PC10: SV1.1 U$1.P78(PC10)
PC12: SV1.3 U$1.P80(PC12)
PC13: SV3.6 U$1.P7(PC13)
PC14: SV3.5 U$1.P8(PC14)
PC15: SV3.4 U$1.P9(PC15)
PD0: SV1.4 U$1.P81(PD0)
PD1: SV1.5 U$1.P82(PD1)
PD2: SV1.6 U$1.P83(PD2)
PD6: U$1.P87(PD6)
PD7: U$1.P88(PD7)
PD8: SV2.1 U$1.P55(PD8)
PD9: SV2.2 U$1.P56(PD9)
PD10: U$1.P57(PD10)
PD11: R11.2 SV2.3 U$1.P58(PD11)
PD12: R12.2 SV2.4 U$1.P59(PD12)
PD13: R13.2 SV2.5 U$1.P60(PD13)
PD14: R14.2 SV2.6 U$1.P61(PD14)
PD15: SV2.7 U$1.P62(PD15)
PE0: U$1.P97(PE0)
PE1: U$1.P98(PE1)
PE2: SV3.16 U$1.P1(PE2)
PE3: SV3.15 U$1.P2(PE3)
PE4: SV3.14 U$1.P3(PE4)
PE5: SV3.13 U$1.P4(PE5)
PE6: SV3.12 U$1.P5(PE6)
PE7: U$1.P38(PE7)
PE8: U$1.P39(PE8)
PE9: U$1.P40(PE9)
PE10: U$1.P41(PE10)
PE11: U$1.P42(PE11)
PE12: U$1.P43(PE12)
PE13: U$1.P44(PE13)
PE14: U$1.P45(PE14)
PE15: U$1.P46(PE15)
PH1: SV3.2 U$1.P13(PH1)
REFCLK: RN3.5 SV5.8 U$1.P24(PA1)
RXD0: RN1.2 SV5.10 U$1.P33(PC4)
RXD1: RN1.1 SV5.9 U$1.P34(PC5)
RXERR: U$4.10(RXER/PHYAD0)
SHIFTREG_CLK: SV1.8 U$1.P85(PD4) U$8.T32
SHIFTREG_DATA: SV1.9 U$1.P86(PD5) U$8.T33
SHIFTREG_ENABLE: SV1.7 U$1.P84(PD3) U$8.T31
SONAR_DAC: U$1.P29(PA4) U$8.B46
SONAR_PWM: SV1.10 U$1.P89(PB3) U$8.T34
TEMP_BACKUP: SV1.2 U$1.P79(PC11) U$8.T25
TXD0: RN3.7 SV5.11 U$1.P51(PB12)
TXD1: RN3.8 SV5.14 U$1.P52(PB13)
TXEN: RN3.6 SV5.12 U$1.P48(PB11)
USB_D+: RN2.3 U$1.P71(PA12)
USB_D-: RN2.4 U$1.P70(PA11)
XTAL1: Q2.3(FO) U$4.5(XTAL1/CLKIN)
XTAL2: U$4.4(XTAL2)
YELLOW: R15.2 U$7.11(Y_GND)
Unconnected: Q1.1(OE) Q2.1(OE) RN1.4 RN1.5 RN4.3 RN4.4 RN4.5 RN4.6 SV5.13 U$6.5(SHDN) U$7.7(NC) U$8.B1 U$8.B2 U$8.B3 U$8.B4 U$8.B5 U$8.B6 U$8.B7 U$8.B8 U$8.B9 U$8.B10 U$8.B11 U$8.B12 U$8.B13 U$8.B14 U$8.B15 U$8.B16 U$8.B17 U$8.B18 U$8.B19 U$8.B20 U$8.B21 U$8.B22 U$8.B23 U$8.B24 U$8.B25 U$8.B26 U$8.B27 U$8.B28 U$8.B29 U$8.B30 U$8.B31 U$8.B32 U$8.B33 U$8.B34 U$8.B37 U$8.B38 U$8.B39 U$8.B40 U$8.B41 U$8.B42 U$8.B43 U$8.B44 U$8.B45 U$8.B47 U$8.B48 U$8.B49 U$8.B50 U$8.B51 U$8.B52 U$8.B53 U$8.B54 U$8.B55 U$8.B56 U$8.B57 U$8.B58 U$8.B59 U$8.B60 U$8.T7 U$8.T8 U$8.T9 U$8.T10 U$8.T19 U$8.T20 U$8.T21 U$8.T22 U$8.T23 U$8.T24 U$8.T26 U$8.T27 U$8.T28 U$8.T29 U$8.T30 U$8.T35 U$8.T36 U$8.T40 U$8.T43 U$8.T44 U$8.T45 U$8.T46 U$8.T47 U$8.T48 U$8.T49 U$8.T50 U$8.T51 U$8.T52 U$8.T53 U$8.T54 U$8.T55 U$8.T56 U$8.T57 U$8.T58 U$8.T59

## Notes on the sheet
- I2C
- I2C
- LAN 8720 PHY Chip | Ethernet Jack
- Micro USB
- LAN 8720 Breakout Board 
  Connection
- Micro USB
- 50 MHz Oscillator

## Library data of the parts
C1-C4 C6 C8 C9 C11 C13 C14 C17 C18 = SparkFun-Passives:CAP: Capacitor Standard 0603 ceramic capacitor, and 0.1" leaded capacitor.
C10 C12 = rcl:C-US: CAPACITOR, American symbol
C15 C16 C19-C21 = eagle-ltspice:C: CAPACITOR, European symbol; SPICEMODEL: NONE; SPICEPREFIX: C
C22 = resistor:C-EU: CAPACITOR, European symbol
D2-D5 = SparkFun-LED:LED: LEDs Standard schematic elements and footprints for 5mm, 3mm, 1206, and 0603 sized LEDs. 5mm - Spark Fun Electronics SKU : COM-00529 (and others)
D6 = DiscreteComponents:DIODE-: DIODE
Q1 = DiscreteComponents:ASF*: CRYSTAL CLOCK OSCILLATORS 5.0 Vdc or 3.3 Vdc - LOW PROFILE ULTRA MINIATURE CERAMIC SURFACE MOUNT Source: http://www.abracon.com/Oscillators/asf1-L-L1.pdf; DIGIKEY: 535-10066-1-ND
Q2 = MicroBoard:ASF*: CRYSTAL CLOCK OSCILLATORS 5.0 Vdc or 3.3 Vdc - LOW PROFILE ULTRA MINIATURE CERAMIC SURFACE MOUNT Source: http://www.abracon.com/Oscillators/asf1-L-L1.pdf; DIGIKEY: 535-10066-1-ND
R1-R6 R8-R14 = SparkFun-Passives:RESISTOR: Resistor Basic schematic elements and footprints for 0603, 1206, and PTH resistors.
R7 R15-R19 R21-R23 = resistor:R-US_: RESISTOR, American symbol
RN1 RN3 RN4 = resistor-dil:4R-N: Array Chip Resistor Source: RS Component / Phycomp; OC_FARNELL: unknown; OC_NEWARK: unknown
RN2 = DiscreteComponents:2R-N: Array Chip Resistor; DIGIKEY: RHM1381CT-ND; MF: Rohm Semiconductor; MPN: MNR12ERAPJ220
SV1-SV3 = con-lsta:FE08-2: FEMALE HEADER; OC_FARNELL: unknown; OC_NEWARK: unknown
SV5 = con-lsta:FE07-2: FEMALE HEADER; OC_FARNELL: unknown; OC_NEWARK: unknown
T3 = DiscreteComponents:FDN340P: MOS FET; DIGIKEY: FDN340PCT-ND
T4 = PowerComponents:AP1117_LIN_REG
U$1 = Other:STM32F4
U$2 U$3 = DiscreteComponents:SWITCH
U$4 = EthernetChip:LAN8720
U$5 = Other:MICROUSB
U$6 = MAX3051 Library:MAX3051: Maxim Integrated MAX3051 CAN Tranciever
U$7 = EthernetChip:J00-0065NL: Ethernet port device.
U$8 = Connectors:HSC8PART-60
U$9 = EthernetChip:553-2382-1-ND

## Net classes
1 DiffPair: width 0.254 mm